# EAGLE design Parola v1.1 (EAGLE 6.4)
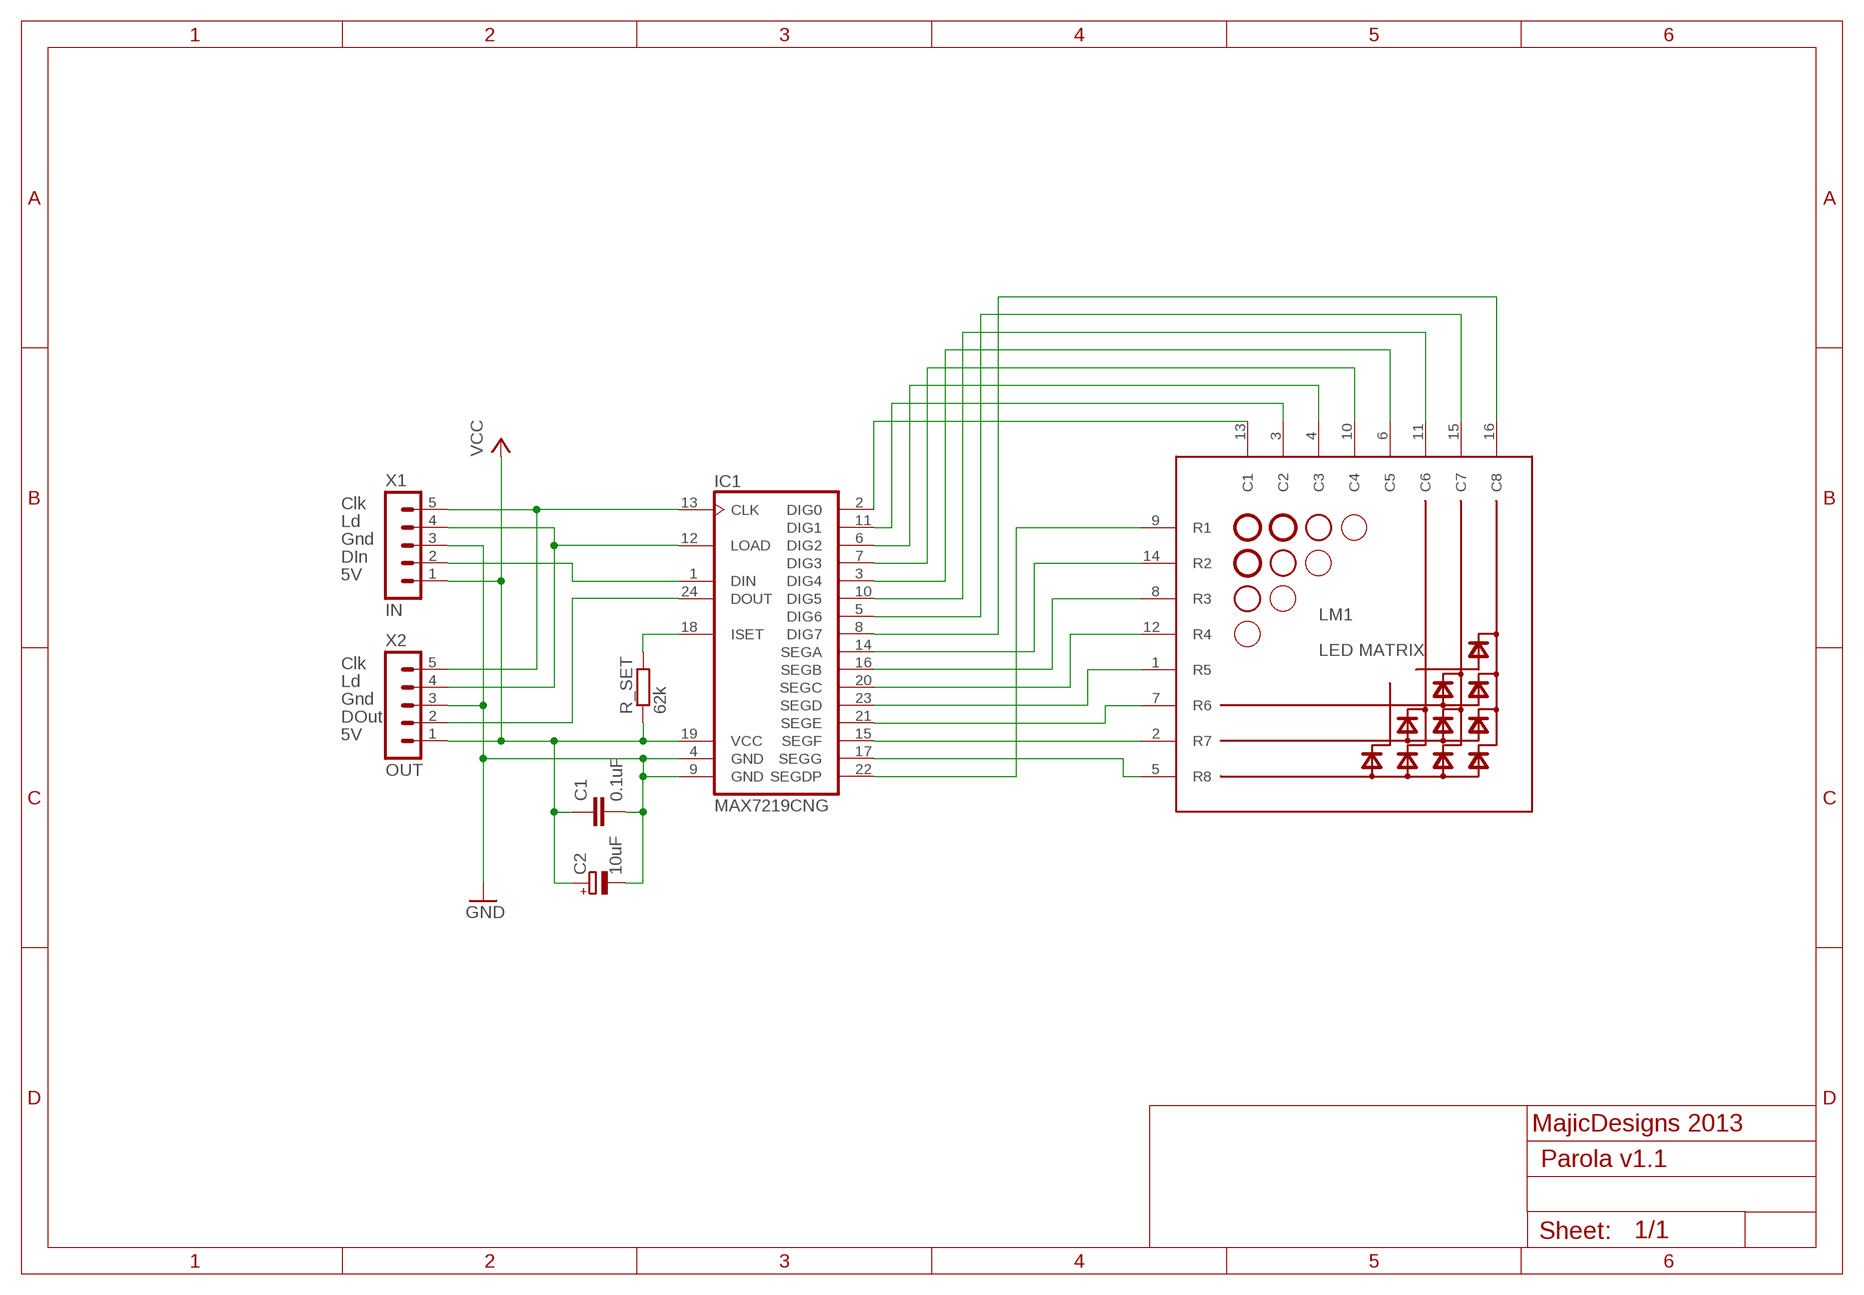
[diagram p0: schematic, sheet 1]

## Parts
C1  0.1uF  C-EU025-024X044  [C025-024X044]
C2  10uF  CPOL-EUE2-5  [E2-5]
IC1  MAX7219CNG  [DIL24-3]
LM1  LED MATRIX  LD-1088BS_LED_MATRIX  [LED_MATRIX]
R_SET  62k  R-EU_0207/10  [0207/10]
X1  IN  MAR05-1  [MAR05-1]
X2  OUT  MAR05-1  [MAR05-1]

## Nets
GND: C1.2 C2.- IC1.4(GND) IC1.9(GND) X1.3 X2.3
N$1: IC1.17(SEGG) LM1.5(R8)
N$2: IC1.15(SEGF) LM1.2(R7)
N$3: IC1.21(SEGE) LM1.7(R6)
N$4: IC1.23(SEGD) LM1.1(R5)
N$5: IC1.20(SEGC) LM1.12(R4)
N$6: IC1.16(SEGB) LM1.8(R3)
N$7: IC1.14(SEGA) LM1.14(R2)
N$8: IC1.22(SEGDP) LM1.9(R1)
N$9: IC1.8(DIG7) LM1.16(C8)
N$10: IC1.5(DIG6) LM1.15(C7)
N$11: IC1.10(DIG5) LM1.11(C6)
N$12: IC1.3(DIG4) LM1.6(C5)
N$13: IC1.7(DIG3) LM1.10(C4)
N$14: IC1.6(DIG2) LM1.4(C3)
N$15: IC1.11(DIG1) LM1.3(C2)
N$16: IC1.2(DIG0) LM1.13(C1)
N$17: IC1.13(CLK) X1.5 X2.5
N$18: IC1.12(LOAD) X1.4 X2.4
N$19: IC1.1(DIN) X1.2
N$20: IC1.24(DOUT) X2.2
N$21: IC1.18(ISET) R_SET.2
VCC: C1.1 C2.+ IC1.19(VCC) R_SET.1 X1.1 X2.1

## Notes on the sheet
- Clk
- Ld
- Gnd
- DIn
- 5V
- Clk
- Ld
- Gnd
- DOut
- 5V
- MajicDesigns 2013

## Library data of the parts
C1 = rcl:C-EU: CAPACITOR, European symbol
C2 = rcl:CPOL-EU: POLARIZED CAPACITOR, European symbol
IC1 = maxim:MAX7219CNG: LED DISPLAY DRIVER; MF: MAXIM; MPN: MAX7219CNG; OC_FARNELL: 1523914; OC_NEWARK: 34C4018
LM1 = MajicDesigns:LD-1088BS_LED_MATRIX: 3mm LED Matrix 8x8 Pin 1 side identified by small semicircular plastic piece on lower edge of package.
R_SET = rcl:R-EU_: RESISTOR, European symbol
X1 X2 = con-lstb:MAR05-1: PIN HEADER; OC_FARNELL: unknown; OC_NEWARK: unknown

## Board
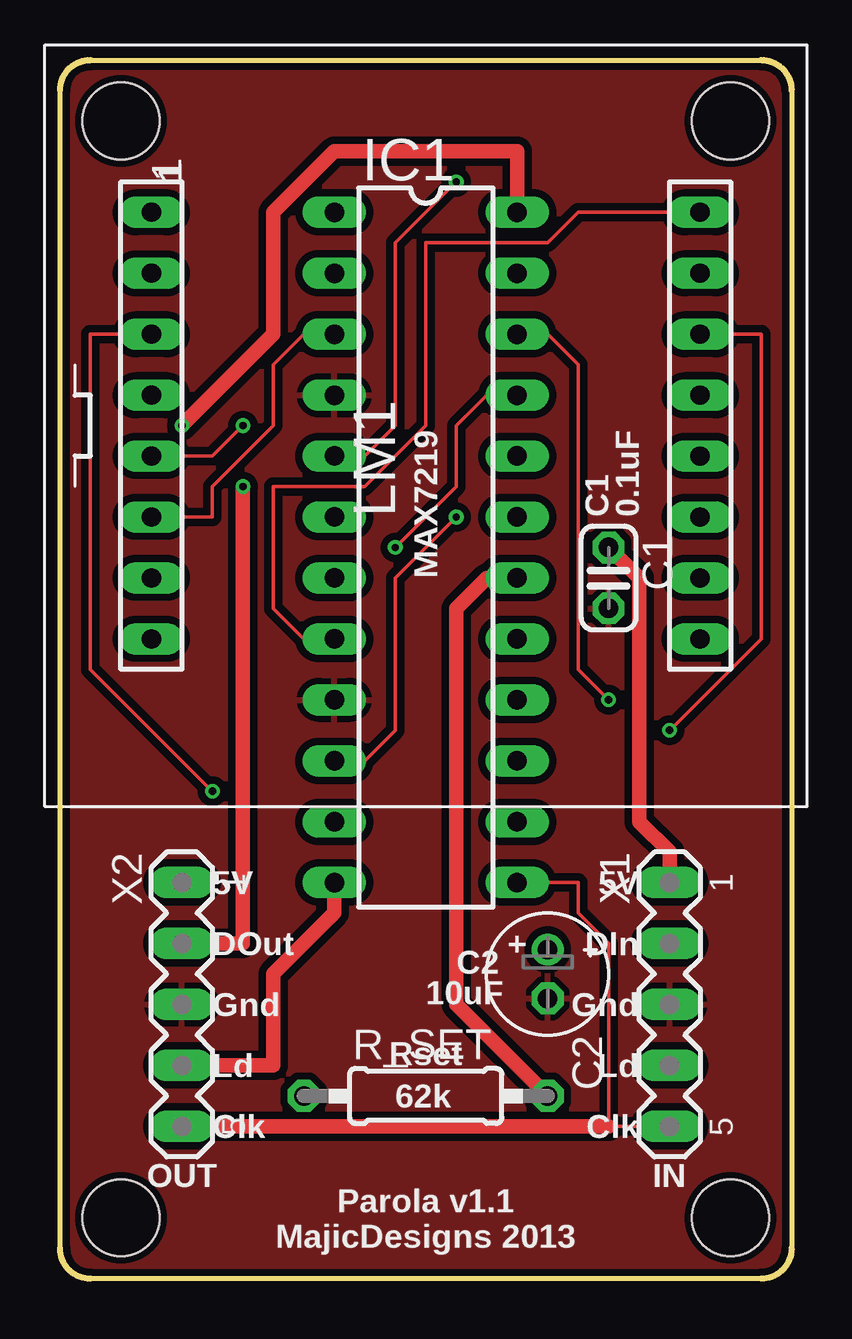
[diagram p1: board, top side]
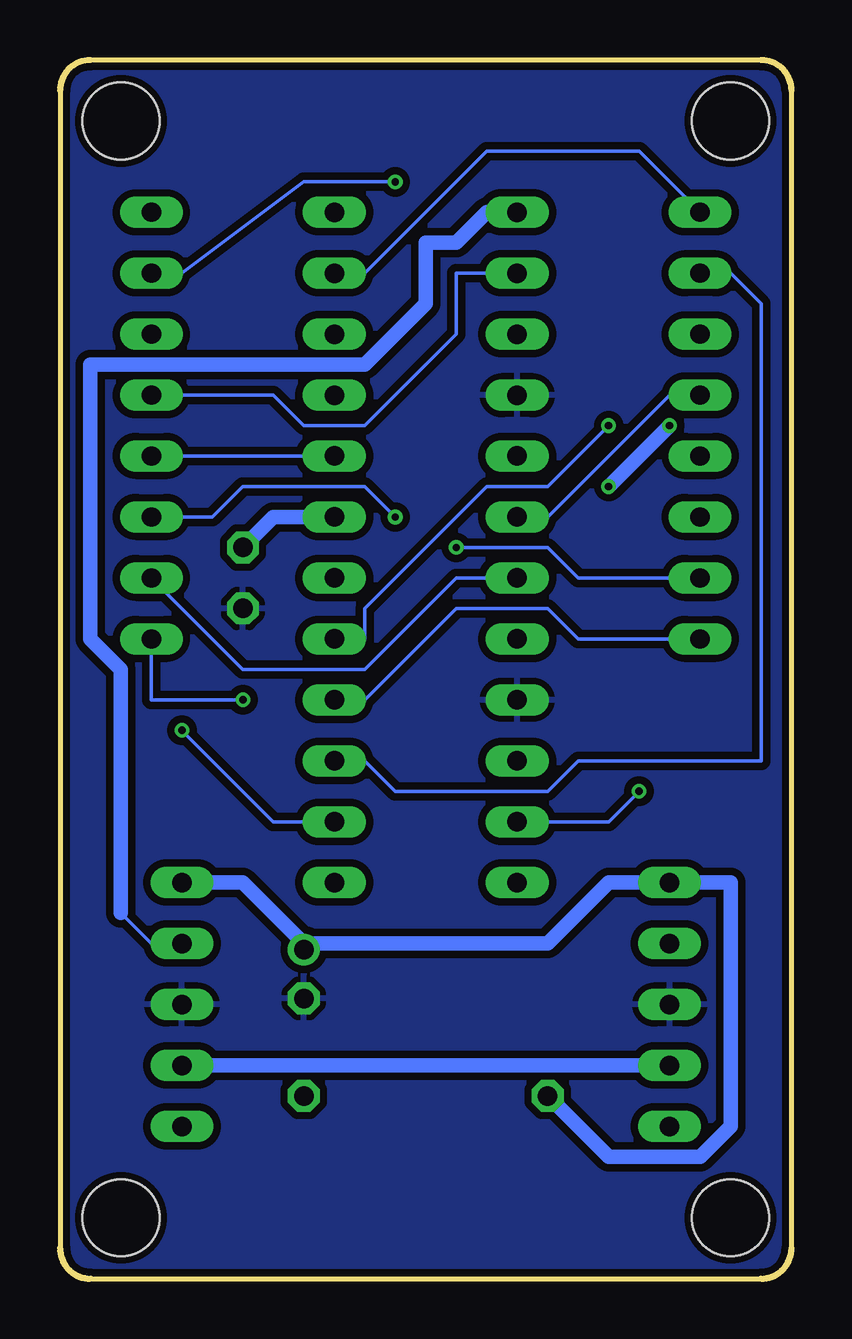
[diagram p2: board, bottom side, seen from below]

Size 30.48 x 50.8 mm. Coordinates in mm from the lower left corner, seen from the top.
Outline: 0,1.27 0,49.53 arc-90 1.27,50.8 29.21,50.8 arc-90 30.48,49.53 30.48,1.27 arc-90 29.21,0 1.27,0 arc-90 0,1.27
Copper layers (1*16): Top 0.035mm / dielectric 1.5mm / Bottom 0.035mm
Design rules "Fusion_eagle_rule_v1.1": minimum track width 6mil, minimum drill 12mil, track to track 6mil, track to pad 6mil, pad to pad 6mil, via to via 6mil, smd to smd 0mil, copper to edge 10mil, drill to drill 10mil, minimum pad ring 10mil, minimum via ring 6mil, stop-mask expansion 2mil, vias tented up to drill 100mil, thermal gap 10mil
Holes 3.2 mm at 2.54,48.26 2.54,2.54 27.94,2.54 27.94,48.26

### Footprints (pad centres in the part's own frame; a part is rotated, then mirrored left to right if it is on the bottom)
C025-024X044 = drill 0.813 octagon: 1 -1.27,0; 2 1.27,0
E2-5 = drill 0.813 pad 1.27: + -1.016,0 | drill 0.813 pad 1.27 octagon: - 1.016,0
DIL24-3 = drill 0.813 long: 1 -13.97,-3.81; 2 -11.43,-3.81; 3 -8.89,-3.81; 4 -6.35,-3.81; 5 -3.81,-3.81; 6 -1.27,-3.81; 7 1.27,-3.81; 8 3.81,-3.81; 9 6.35,-3.81; 10 8.89,-3.81; 11 11.43,-3.81; 12 13.97,-3.81; 13 13.97,3.81; 14 11.43,3.81; 15 8.89,3.81; 16 6.35,3.81; 17 3.81,3.81; 18 1.27,3.81; 19 -1.27,3.81; 20 -3.81,3.81; 21 -6.35,3.81; 22 -8.89,3.81; 23 -11.43,3.81; 24 -13.97,3.81
LED_MATRIX = drill 0.8 long: 1 8.89,11.43; 2 6.35,11.43; 3 3.81,11.43; 4 1.27,11.43; 5 -1.27,11.43; 6 -3.81,11.43; 7 -6.35,11.43; 8 -8.89,11.43; 9 -8.89,-11.43; 10 -6.35,-11.43; 11 -3.81,-11.43; 12 -1.27,-11.43; 13 1.27,-11.43; 14 3.81,-11.43; 15 6.35,-11.43; 16 8.89,-11.43
0207/10 = drill 0.813 octagon: 1 -5.08,0; 2 5.08,0
MAR05-1 = drill 0.813 long: 1 -5.08,0; 2 -2.54,0; 3 0,0; 4 2.54,0; 5 5.08,0

### Placement (x,y rotation side)
C1  22.86,29.21 270 top
C2  20.32,12.7 270 top
IC1  15.24,30.48 270 top
LM1  15.24,35.56 90 top
R_SET  15.24,7.62 0 top
X1  25.4,11.43 270 top
X2  5.08,11.43 270 top

### Tracks (layer width: path | path; a pad name or v marks a point on that pad's centre or on a via)
GND
  pour Bottom (isolate 0.305): 0,50.8 30.48,50.8 30.48,0 0,0
  pour Top (isolate 0.305): 0,50.8 30.48,50.8 30.48,0 0,0
N$1  (via drill 0.3)
  Top 0.152: LM1.5 6.35,34.29 v7.62,35.56
  Bottom 0.152: v7.62,35.56 10.16,33.02 12.7,33.02 17.78,27.94 17.78,26.67 IC1.17
N$2
  Bottom 0.152: LM1.2 2.54,41.91 1.27,40.64 1.27,21.59 8.89,21.59 10.16,20.32 16.51,20.32 17.78,21.59 IC1.15
N$3  (via drill 0.3)
  Top 0.152: v13.97,30.48 16.51,33.02 16.51,35.56 17.78,36.83 IC1.21
  Bottom 0.152: LM1.7 8.89,29.21 10.16,30.48 v13.97,30.48
N$4
  Bottom 0.152: LM1.1 6.35,46.99 12.7,46.99 17.78,41.91 IC1.23
N$5
  Bottom 0.152: IC1.20 LM1.12
N$6
  Bottom 0.152: LM1.8 8.89,26.67 10.16,27.94 13.97,27.94 17.78,24.13 IC1.16
N$7  (via drill 0.3)
  Top 0.152: LM1.14 29.21,39.37 29.21,26.67 v25.4,22.86
  Bottom 0.152: v25.4,22.86 21.59,19.05 IC1.14
N$8  (via drill 0.3)
  Top 0.152: v22.86,24.13 21.59,25.4 21.59,38.1 20.32,39.37 IC1.22
  Bottom 0.152: LM1.9 26.67,24.13 v22.86,24.13
N$9
  Top 0.152: LM1.16 21.59,44.45 20.32,43.18 15.24,43.18 15.24,35.56 12.7,33.02 8.89,33.02 8.89,27.94 10.16,26.67 IC1.8
N$10  (via drill 0.3)
  Top 0.152: v16.51,45.72 13.97,43.18 13.97,35.56 12.7,34.29 IC1.5
  Bottom 0.152: LM1.15 25.4,41.91 20.32,45.72 v16.51,45.72
N$11  (via drill 0.3)
  Top 0.152: v16.51,31.75 13.97,29.21 13.97,22.86 12.7,21.59 IC1.10
  Bottom 0.152: LM1.11 24.13,31.75 22.86,33.02 17.78,33.02 v16.51,31.75
N$12
  Top 0.152: LM1.6 6.35,31.75 6.35,33.02 8.89,35.56 8.89,38.1 10.16,39.37 IC1.3
N$13
  Bottom 0.152: LM1.10 22.86,25.4 17.78,25.4 13.97,29.21 IC1.7
N$14
  Bottom 0.152: LM1.4 5.08,36.83 10.16,31.75 IC1.6
N$15  (via drill 0.3)
  Top 0.152: LM1.3 1.27,39.37 1.27,25.4 v6.35,20.32
  Bottom 0.152: v6.35,20.32 7.62,19.05 IC1.11
N$16
  Bottom 0.152: LM1.13 21.59,36.83 20.32,35.56 17.78,35.56 13.97,39.37 13.97,41.91 IC1.2
N$17
  Top 0.152: X1.5 22.86,6.35 22.86,13.97 21.59,15.24 21.59,16.51 IC1.13
  Top 0.61: 22.86,6.35 X2.5
N$18
  Top 0.61: X2.4 8.89,8.89 8.89,12.7 11.43,15.24 IC1.12
  Bottom 0.61: X2.4 X1.4
N$19
  Bottom 0.152: X1.2 26.67,13.97 27.94,15.24
  Bottom 0.61: 27.94,15.24 27.94,25.4 29.21,26.67 29.21,38.1 17.78,38.1 15.24,40.64 15.24,43.18 13.97,43.18 12.7,44.45 IC1.1
N$20  (via drill 0.3)
  Top 0.61: X2.2 7.62,13.97 v7.62,33.02 | v5.08,35.56 8.89,39.37 8.89,44.45 11.43,46.99 19.05,46.99 IC1.24
  Bottom 0.61: v5.08,35.56 v7.62,33.02
N$21
  Top 0.61: R_SET.2 16.51,11.43 16.51,27.94 17.78,29.21 IC1.18
VCC
  Top 0.61: C1.1 24.13,29.21 24.13,19.05 25.4,17.78 X1.1
  Bottom 0.152: 20.32,13.97 C2.+
  Bottom 0.61: R_SET.1 7.62,5.08 3.81,5.08 2.54,6.35 2.54,16.51 X2.1 7.62,16.51 10.16,13.97 20.32,13.97 22.86,16.51 X1.1 | IC1.19 21.59,31.75 C1.1

### Text on the board
_tplace: 1 | C1 | 0.1uF | MAX7219 | 5V | 5V | DOut | + | DIn | C2 | Gnd | 10uF | Gnd | Ld | Rset | Ld | 62k | Clk | Clk | OUT | IN | Parola v1.1 / MajicDesigns 2013